# Altium schematic sheet A3010_Adelaide_8MB_IDE_RAM2.SchDoc: ARM2 to ARM3 Adapter
size A3; DocumentNumber: 1; SheetNumber: 3; SheetTotal: 3
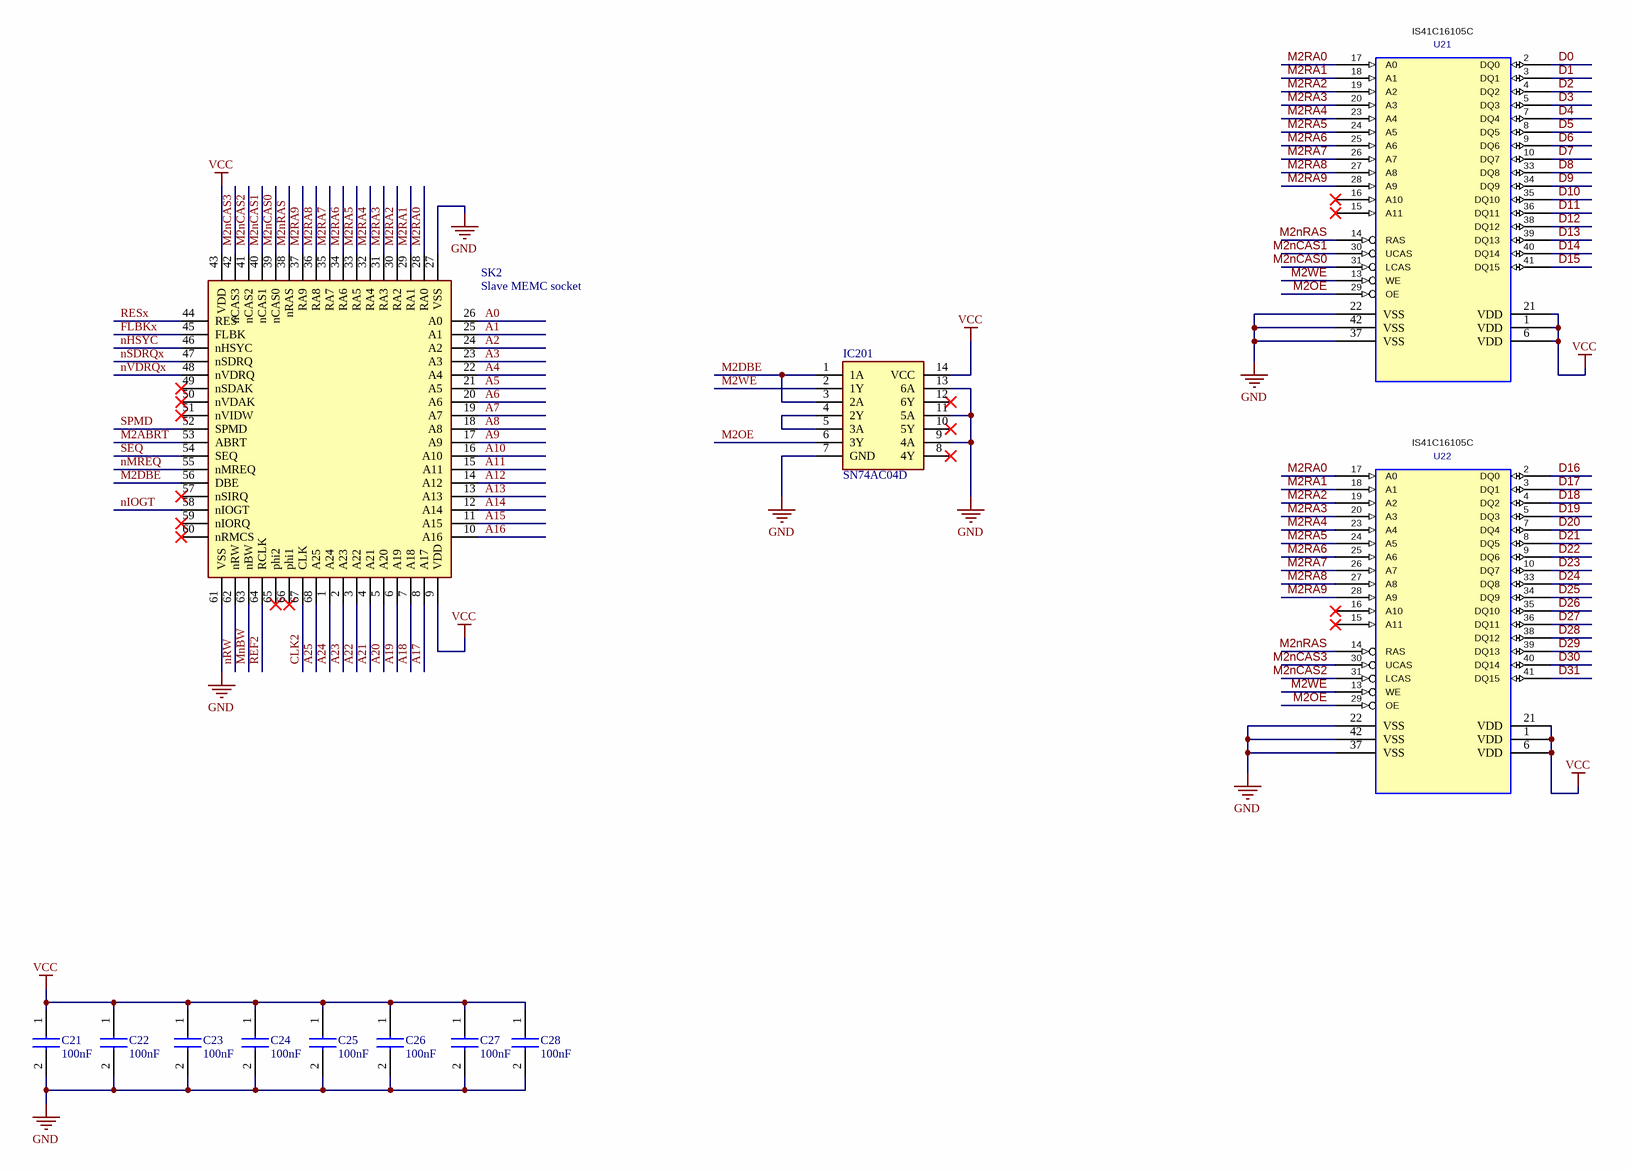
[diagram p0: A3010_Adelaide_8MB_IDE_RAM2.SchDoc]

## Parts
C21  100nF  [CAPC2012X145N]
C22  100nF  [CAPC2012X145N]
C23  100nF  [CAPC2012X145N]
C24  100nF  [CAPC2012X145N]
C25  100nF  [CAPC2012X145N]
C26  100nF  [CAPC2012X145N]
C27  100nF  [CAPC2012X145N]
C28  100nF  [CAPC2012X145N]
IC201  SN74AC04D  [SOIC127P600X175-14N]
SK2  Slave MEMC socket  [MEMC_Socket]
U21  IS41C16105C  [SOJ-42]
U22  IS41C16105C  [SOJ-42]

## Nets
GND: C21.2 C22.2 C23.2 C24.2 C25.2 C26.2 C27.2 C28.2 IC201.7(GND) IC201.9(4A) IC201.11(5A) IC201.13(6A) SK2.27(VSS) SK2.61(VSS) U21.22(VSS) U21.37(VSS) U21.42(VSS) U22.22(VSS) U22.37(VSS) U22.42(VSS)
VCC: C21.1 C22.1 C23.1 C24.1 C25.1 C26.1 C27.1 C28.1 IC201.14(VCC) SK2.9(VDD) SK2.43(VDD) U21.1(VCC) U21.6(VCC) U21.21(VCC) U22.1(VCC) U22.6(VCC) U22.21(VCC)
A0: SK2.26(A0)
A1: SK2.25(A1)
A2: SK2.24(A2)
A3: SK2.23(A3)
A4: SK2.22(A4)
A5: SK2.21(A5)
A6: SK2.20(A6)
A7: SK2.19(A7)
A8: SK2.18(A8)
A9: SK2.17(A9)
A10: SK2.16(A10)
A11: SK2.15(A11)
A12: SK2.14(A12)
A13: SK2.13(A13)
A14: SK2.12(A14)
A15: SK2.11(A15)
A16: SK2.10(A16)
A17: SK2.8(A17)
A18: SK2.7(A18)
A19: SK2.6(A19)
A20: SK2.5(A20)
A21: SK2.4(A21)
A22: SK2.3(A22)
A23: SK2.2(A23)
A24: SK2.1(A24)
A25: SK2.68(A25)
CLK2: SK2.67(CLK)
D0: U21.2(DQ0)
D1: U21.3(DQ1)
D2: U21.4(DQ2)
D3: U21.5(DQ3)
D4: U21.7(DQ4)
D5: U21.8(DQ5)
D6: U21.9(DQ6)
D7: U21.10(DQ7)
D8: U21.33(DQ8)
D9: U21.34(DQ9)
D10: U21.35(DQ10)
D11: U21.36(DQ11)
D12: U21.38(DQ12)
D13: U21.39(DQ13)
D14: U21.40(DQ14)
D15: U21.41(DQ15)
D16: U22.2(DQ0)
D17: U22.3(DQ1)
D18: U22.4(DQ2)
D19: U22.5(DQ3)
D20: U22.7(DQ4)
D21: U22.8(DQ5)
D22: U22.9(DQ6)
D23: U22.10(DQ7)
D24: U22.33(DQ8)
D25: U22.34(DQ9)
D26: U22.35(DQ10)
D27: U22.36(DQ11)
D28: U22.38(DQ12)
D29: U22.39(DQ13)
D30: U22.40(DQ14)
D31: U22.41(DQ15)
FLBKx: SK2.45(FLBK)
M2ABRT: SK2.53(ABRT)
M2DBE: IC201.1(1A) IC201.3(2A) SK2.56(DBE)
M2nCAS0: SK2.39(nCAS0) U21.31(LCAS)
M2nCAS1: SK2.40(nCAS1) U21.30(UCAS)
M2nCAS2: SK2.41(nCAS2) U22.31(LCAS)
M2nCAS3: SK2.42(nCAS3) U22.30(UCAS)
M2nRAS: SK2.38(nRAS) U21.14(RAS) U22.14(RAS)
M2OE: IC201.6(3Y) U21.29(OE) U22.29(OE)
M2RA0: SK2.28(RA0) U21.17(A0) U22.17(A0)
M2RA1: SK2.29(RA1) U21.18(A1) U22.18(A1)
M2RA2: SK2.30(RA2) U21.19(A2) U22.19(A2)
M2RA3: SK2.31(RA3) U21.20(A3) U22.20(A3)
M2RA4: SK2.32(RA4) U21.23(A4) U22.23(A4)
M2RA5: SK2.33(RA5) U21.24(A5) U22.24(A5)
M2RA6: SK2.34(RA6) U21.25(A6) U22.25(A6)
M2RA7: SK2.35(RA7) U21.26(A7) U22.26(A7)
M2RA8: SK2.36(RA8) U21.27(A8) U22.27(A8)
M2RA9: SK2.37(RA9) U21.28(A9) U22.28(A9)
M2WE: IC201.2(1Y) U21.13(WE) U22.13(WE)
MnBW: SK2.63(nBW)
nHSYC: SK2.46(nHSYC)
nIOGT: SK2.58(nIOGT)
nMREQ: SK2.55(nMREQ)
nRW: SK2.62(nRW)
nSDRQx: SK2.47(nSDRQ)
nVDRQx: SK2.48(nVDRQ)
REF2: SK2.64(RCLK)
RESx: SK2.44(RES)
SEQ: SK2.54(SEQ)
SPMD: SK2.52(SPMD)
NetIC201_4: IC201.4(2Y) IC201.5(3A)

Not connected (* = marked no-connect by the designer): IC201 8(4Y)* 10(5Y)* 12(6Y)*; SK2 49(nSDAK)* 50(nVDAK)* 51(nVIDW)* 57(nSIRQ)* 59(nIORQ)* 60(nRMCS)* 65(phi2)* 66(phi1)*; U21 15(A11)* 16(A10)*; U22 15(A11)* 16(A10)*

## Notes on the sheet
- SIZE
- CODION LTD
- DIMENSIONS
- TITLE
- VARIANT
- REVISION
- DATE
- A3
- SHEET
- OF
- FILE
- DRAWN BY

## Library data of the parts
C21-C28 = C2012X7R1H104K125AM: Capacitor; Manufacturer_Name: TDK; Datasheet Link: https://product.tdk.com/info/en/catalog/datasheets/mlcc_commercial_midvoltage_en.pdf; Height: 1.45mm; Manufacturer_Part_Number: C2012X7R1H104K125AM; Mouser Part Number: 810-C2012X7R1H104KT5; Mouser Price/Stock: https://www.mouser.com/Search/Refine.aspx?Keyword=810-C2012X7R1H104KT5; Arrow Part Number: C2012X7R1H104K125AM; Arrow Price/Stock: https://www.arrow.com/en/products/c2012x7r1h104k125am/tdk
IC201 = SN74AC04D: Integrated Circuit; Manufacturer_Name: Texas Instruments; Datasheet Link: http://www.ti.com/lit/ds/symlink/sn74ac04.pdf; Height: 1.75mm; Manufacturer_Part_Number: SN74AC04D; Mouser Part Number: 595-SN74AC04D; Mouser Price/Stock: https://www.mouser.co.uk/ProductDetail/Texas-Instruments/SN74AC04D?qs=w32V8uFkMxkvsyMHHacuZw%3D%3D; Arrow Part Number: SN74AC04D; Arrow Price/Stock: https://www.arrow.com/en/products/sn74ac04d/texas-instruments?region=nac
SK2 = MEMC_Skt: MEMC socket; Manufacturer_Name: 3M; Manufacturer_Part_Number: 8468-21B1-RK-TR; Datasheet Link: https://www.arrow.com/en/products/8468-21b1-rk-tr/3m; Height: 4.6mm; Mouser Part Number: 517-8468-21B1-RK-TR; Mouser Price/Stock: https://www.mouser.co.uk/ProductDetail/3M-Electronic-Solutions-Division/8468-21B1-RK-TR?qs=X%2F%2F06fXhnJ18zOj3KK47CQ%3D%3D; Arrow Part Number: 8468-21B1-RK-TR; Arrow Price/Stock: https://www.arrow.com/en/products/8468-21b1-rk-tr/3m
U21 U22 = DRAM_1MX16_SOJ: Value: IS41C16105C